# Altium schematic sheet Notes.SchDoc
size A4; SheetNumber: 13; SheetTotal: 13
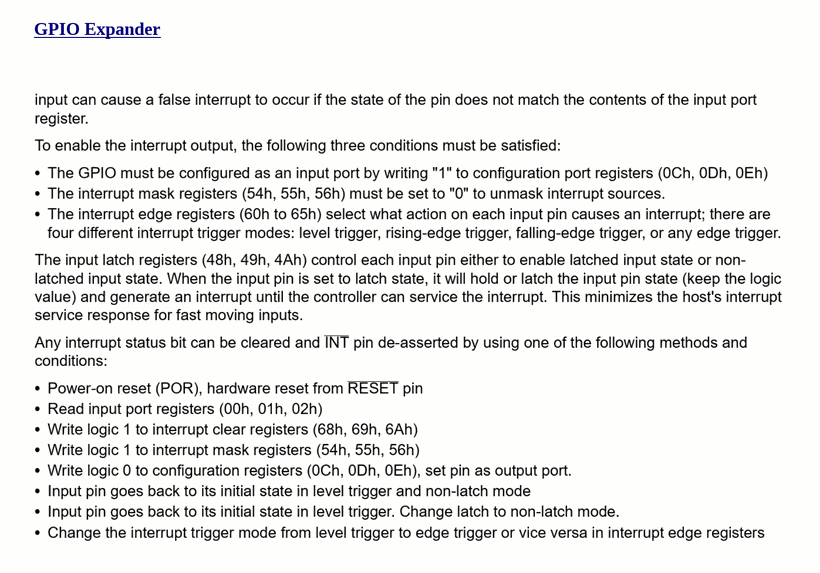
[diagram p0: Notes.SchDoc]

## Notes on the sheet
- GPIO Expander